# Altium schematic sheet IO_Driver.SchDoc: IO Driver
size Letter; Engineer: Brandt Buchda; Revision: B; SheetNumber: 2; SheetTotal: 4
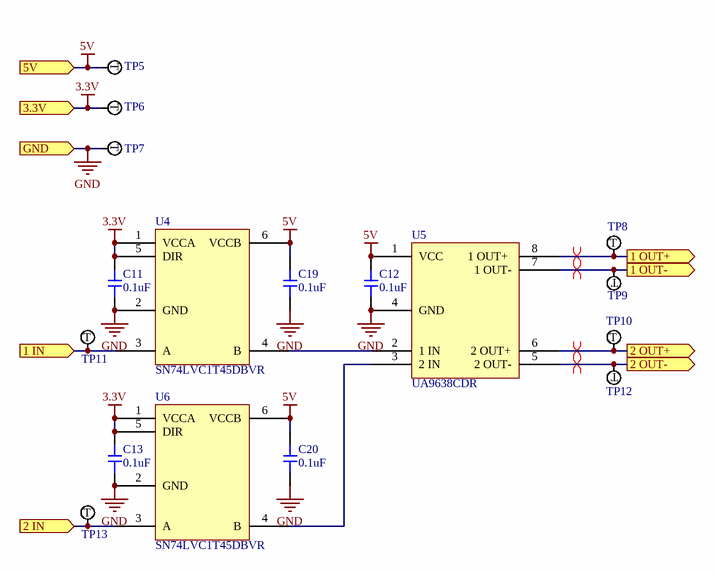
[diagram p0: IO_Driver.SchDoc]

## Parts
C11  value 0.1uF  [0603-CAP]  (hidden comment: CC0603KRX7R8BB104)
C12  value 0.1uF  [0603-CAP]  (hidden comment: CC0603KRX7R8BB104)
C13  value 0.1uF  [0603-CAP]  (hidden comment: CC0603KRX7R8BB104)
C19  value 0.1uF  [0603-CAP]  (hidden comment: CC0603KRX7R8BB104)
C20  value 0.1uF  [0603-CAP]  (hidden comment: CC0603KRX7R8BB104)
TP5  RCU-0C  [RCU-0C]  (value not drawn)
TP6  RCU-0C  [RCU-0C]  (value not drawn)
TP7  RCU-0C  [RCU-0C]  (value not drawn)
TP8  RCU-0C  [RCU-0C]  (value not drawn)
TP9  RCU-0C  [RCU-0C]  (value not drawn)
TP10  RCU-0C  [RCU-0C]  (value not drawn)
TP11  RCU-0C  [RCU-0C]  (value not drawn)
TP12  RCU-0C  [RCU-0C]  (value not drawn)
TP13  RCU-0C  [RCU-0C]  (value not drawn)
U4  SN74LVC1T45DBVR  [SOT95P280X145-6N]
U5  UA9638CDR  [SOIC127P600X175-8N]
U6  SN74LVC1T45DBVR  [SOT95P280X145-6N]

## Ports
1 IN (in), 1 OUT+ (out), 1 OUT- (out), 2 IN (in), 2 OUT+ (out), 2 OUT- (out), 3.3V (in), 5V (in), GND (in)

## Nets
3.3V: C11.2 C13.2 TP6.1 U4.1(VCCA) U4.5(DIR) U6.1(VCCA) U6.5(DIR) ; port 3.3V
5V: C12.2 C19.2 C20.2 TP5.1 U4.6(VCCB) U5.1(VCC) U6.6(VCCB) ; port 5V
GND: C11.1 C12.1 C13.1 C19.1 C20.1 TP7.1 U4.2(GND) U5.4(GND) U6.2(GND) ; port GND
1 IN: TP11.1 U4.3(A) ; port 1 IN
1 OUT+: TP8.1 U5.8(1_OUT+) ; port 1 OUT+
1 OUT-: TP9.1 U5.7(1_OUT-) ; port 1 OUT-
2 IN: TP13.1 U6.3(A) ; port 2 IN
2 OUT+: TP10.1 U5.6(2_OUT+) ; port 2 OUT+
2 OUT-: TP12.1 U5.5(2_OUT-) ; port 2 OUT-
NetU4_4: U4.4(B) U5.2(1_IN)
NetU5_3: U5.3(2_IN) U6.4(B)

## Layout directives
differential pair: 1 OUT+, 1 OUT-, 2 OUT+, 2 OUT-

## Notes on the sheet
- Title:
- File:
- Sheet:
- of
- Revision:
- Time:
- Date:
- Engineer:
- (in symbol Test Point) T

## Library data of the parts
C11-C13 C19 C20 = Capacitor 0.1uF: 0.1µF ±10% 25V Ceramic Capacitor X7R 0603 (1608 Metric); Supplier 1: Digi-Key; Supplier Part Number 1: 311-1341-1-ND
TP5-TP13 = Test Point: PC TEST POINT NATURAL; Material - Insulation: No Insulation; Manufacturer Part Number: RCU-0C; Supplier Part Number: *; Supplier: *; Footprint: *; Supplier 1: Digi-Key; RoHS: RoHS Compliant; Category: Test and Measurement; Stock 1: 136646; Pricing 1: 1=0.22, 10=0.206, 25=0.1756, 50=0.1536, 100=0.1426, 250=0.12616, 500=0.12068, 1000=0.09874 (USD); Packaging: Cut Tape (CT); Part Status: Active; Type: PC Test Point; Mounting Type: Surface Mount; Color: Natural; Size / Dimension: 0.063" x 0.031" x 0.045" (1.60mm x 0.80mm x 1.15mm); Plating: -; Material - Body: -; ComponentLink1URL: http://www.te.com/commerce/DocumentDelivery/DDEController?Action=srchrtrv&DocNm=1773266&DocType=DS&DocLang=English; ComponentLink1Description: http://www.te.com/commerce/DocumentDelivery/DDEController?Action=srchrtrv&DocNm=1773266&DocType=DS&DocLang=English; Supplier Part Number 1: A106145CT-ND
U4 U6 = SN74LVC1T45DBVR: IC TRNSLTR BIDIRECTIONAL SOT23-6; Supplier 1: Digi-Key; Supplier Part Number 1: 296-16843-1-ND
U5 = UA9638CDR: IC DRIVER 2/0 8SOIC; Supplier 1: DigiKey; Supplier Part Number 1: 296-15058-1-ND